# EAGLE design atxmega_e5 (EAGLE 6.5.0)
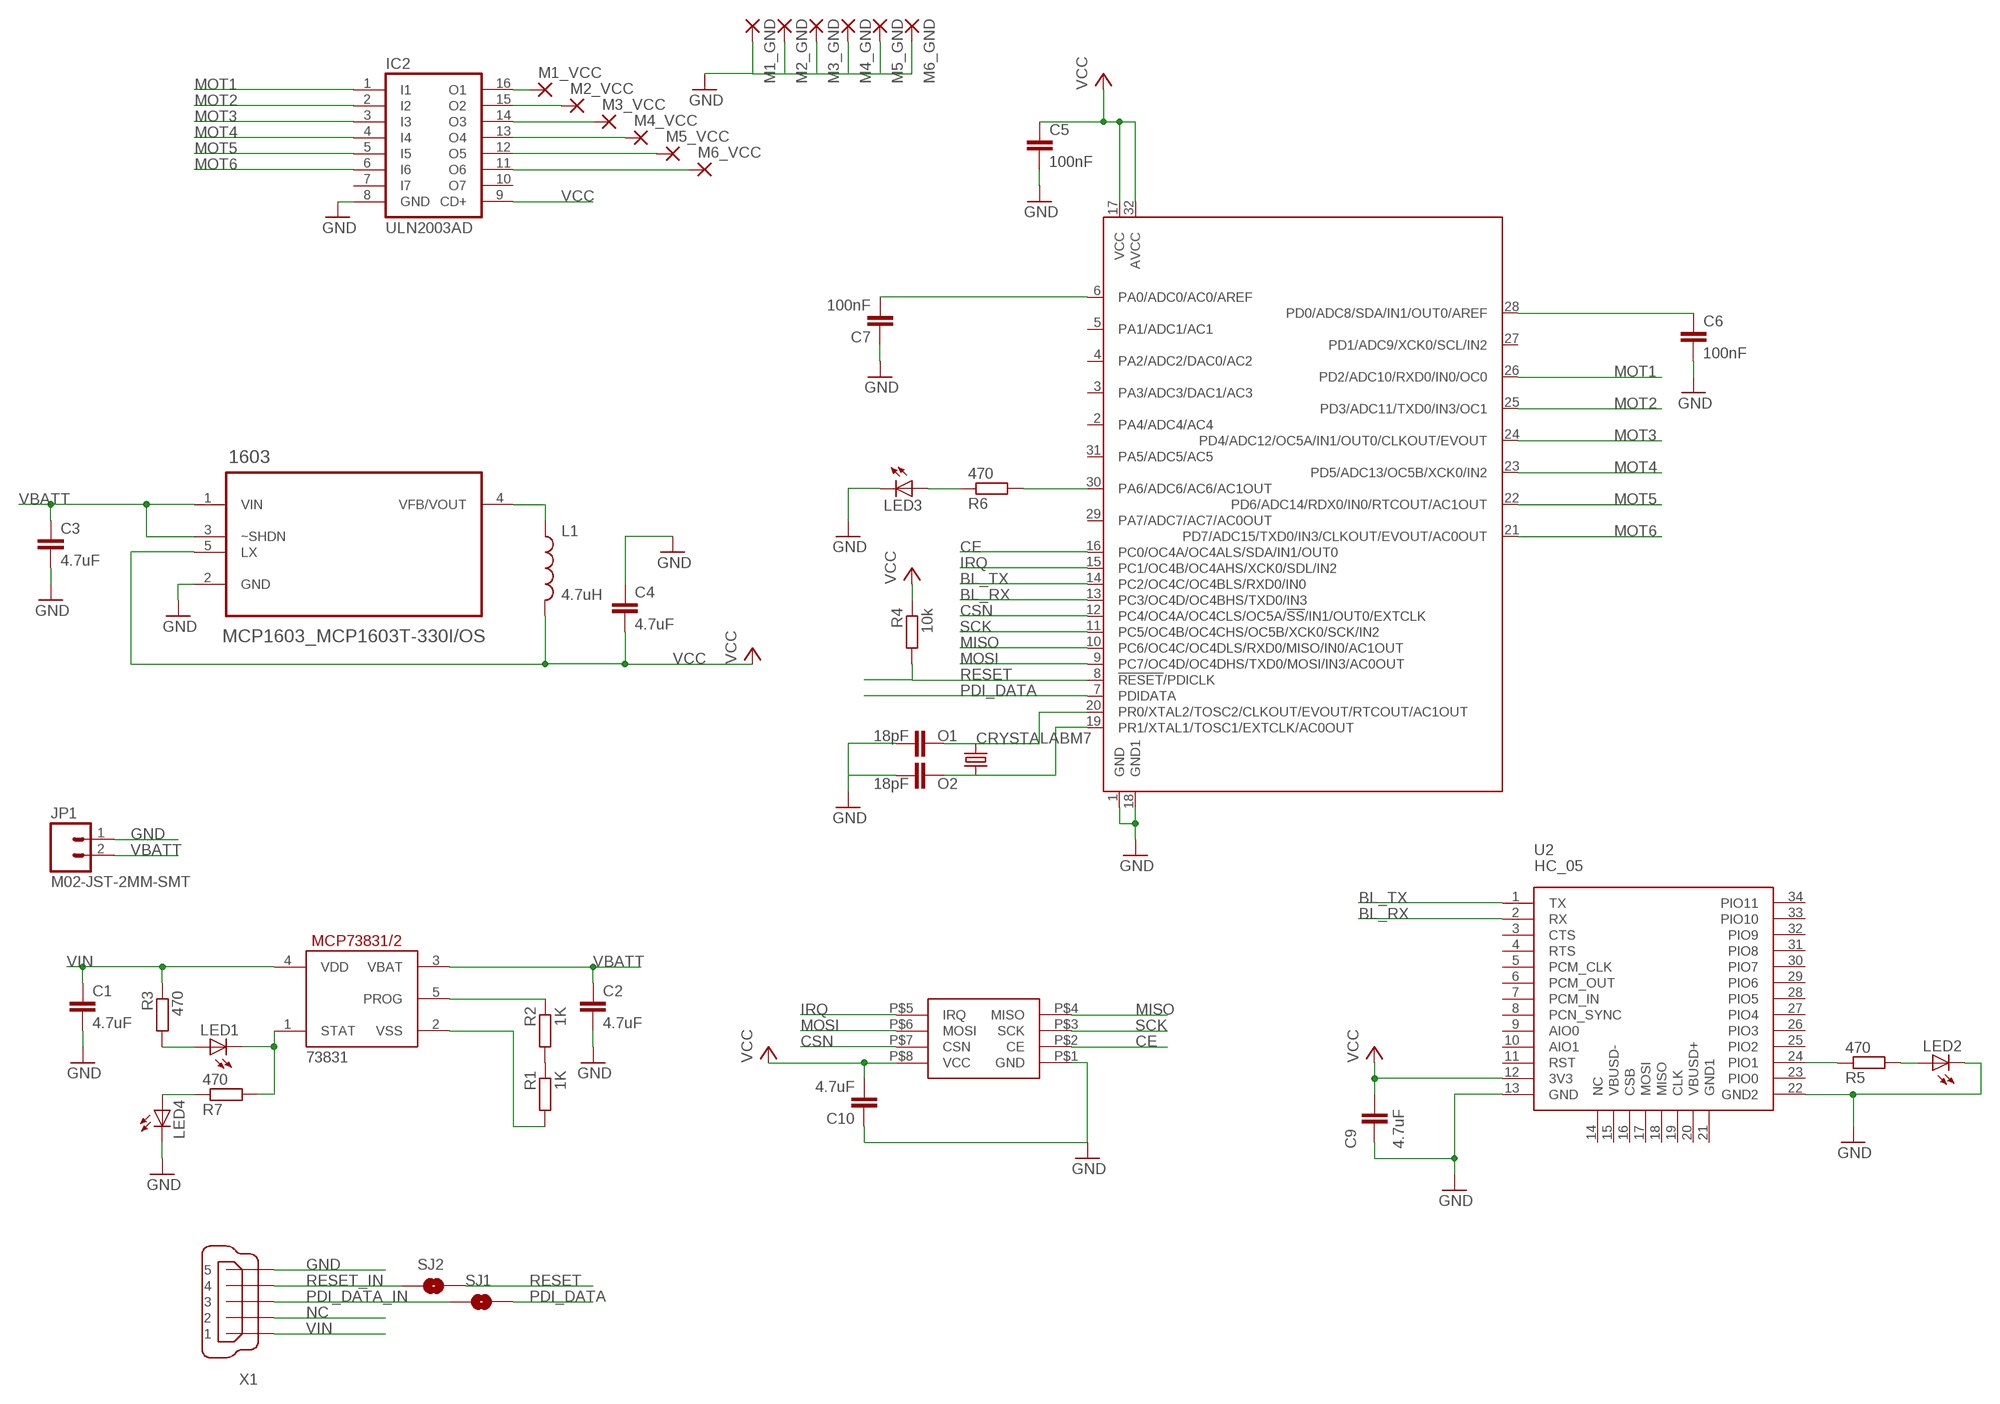
[diagram p0: schematic, sheet 1]

## Parts
1603  MCP1603_MCP1603T-330I/OS  [MCP1603_SOT95P280X110-5N]
73831  MCP73831/OT  [SOT23-5L]
C1  4.7uF  C-EUC0603K  [C0603K]
C2  4.7uF  C-EUC0603K  [C0603K]
C3  4.7uF  C-EUC0603K  [C0603K]
C4  4.7uF  C-EUC0603K  [C0603K]
C5  100nF  C-EUC0603K  [C0603K]
C6  100nF  C-EUC0603K  [C0603K]
C7  100nF  C-EUC0603K  [C0603K]
C9  4.7uF  C-EUC0603K  [C0603K]
C10  4.7uF  C-EUC0603K  [C0603K]
IC2  ULN2003AD  [SO16]
JP1  M02-JST-2MM-SMT  [JST-2-SMD]
L1  4.7uH  INDUCTOR1007  [1007]
LED1  LED0805LED  [0805LED]
LED2  LED0805LED  [0805LED]
LED3  LED0805LED  [0805LED]
LED4  LED0805LED  [0805LED]
M1_GND  WIREPAD2,15/1,0  [2,15/1,0]
M1_VCC  WIREPAD2,15/1,0  [2,15/1,0]
M2_GND  WIREPAD2,15/1,0  [2,15/1,0]
M2_VCC  WIREPAD2,15/1,0  [2,15/1,0]
M3_GND  WIREPAD2,15/1,0  [2,15/1,0]
M3_VCC  WIREPAD2,15/1,0  [2,15/1,0]
M4_GND  WIREPAD2,15/1,0  [2,15/1,0]
M4_VCC  WIREPAD2,15/1,0  [2,15/1,0]
M5_GND  WIREPAD2,15/1,0  [2,15/1,0]
M5_VCC  WIREPAD2,15/1,0  [2,15/1,0]
M6_GND  WIREPAD2,15/1,0  [2,15/1,0]
M6_VCC  WIREPAD2,15/1,0  [2,15/1,0]
O1  18pF  C-EUC0603K  [C0603K]
O2  18pF  C-EUC0603K  [C0603K]
R1  1K  R-EU_R0603  [R0603]
R2  1K  R-EU_R0603  [R0603]
R3  470  R-EU_R0603  [R0603]
R4  10k  R-EU_R0603  [R0603]
R5  470  R-EU_R0603  [R0603]
R6  470  R-EU_R0603  [R0603]
R7  470  R-EU_R0603  [R0603]
SJ1  SOLDERJUMPERNO  [SJ_2S-NO]
SJ2  SOLDERJUMPERNO  [SJ_2S-NO]
U1  ATXMEGAE5AU  [TQFP32]
U2  HC_05  [BLUETOOTH_SMD]
U$1  CRYSTALABM7  [ABM7]
U$2  NRF24L01+  [NRF24L01+]
X1  MINI-USB-32005-201  [32005-201]

## Nets
BL_RX: U1.13(PC3/OC4D/OC4BHS/TXD0/IN3) U2.2(RX)
BL_TX: U1.14(PC2/OC4C/OC4BLS/RXD0/IN0) U2.1(TX)
CE: U1.16(PC0/OC4A/OC4ALS/SDA/IN1/OUT0) U$2.P$2(CE)
CSN: U1.12(PC4/OC4A/OC4CLS/OC5A/!SS!/IN1/OUT0/EXTCLK) U$2.P$7(CSN)
GND: 1603.2(GND) C1.2 C2.2 C3.2 C4.1 C5.2 C6.2 C7.1 C9.2 C10.1 IC2.8(GND) JP1.1 LED2.C LED3.C LED4.C M1_GND.1(P) M2_GND.1(P) M3_GND.1(P) M4_GND.1(P) M5_GND.1(P) M6_GND.1(P) O1.2 O2.2 U1.1(GND) U1.18(GND1) U2.13(GND) U2.22(GND2) U$2.P$1(GND) X1.5
IRQ: U1.15(PC1/OC4B/OC4AHS/XCK0/SDL/IN2) U$2.P$5(IRQ)
MISO: U1.10(PC6/OC4C/OC4DLS/RXD0/MISO/IN0/AC1OUT) U$2.P$4(MISO)
MOSI: U1.9(PC7/OC4D/OC4DHS/TXD0/MOSI/IN3/AC0OUT) U$2.P$6(MOSI)
MOT1: IC2.1(I1) U1.26(PD2/ADC10/RXD0/IN0/OC0)
MOT2: IC2.2(I2) U1.25(PD3/ADC11/TXD0/IN3/OC1)
MOT3: IC2.3(I3) U1.24(PD4/ADC12/OC5A/IN1/OUT0/CLKOUT/EVOUT)
MOT4: IC2.4(I4) U1.23(PD5/ADC13/OC5B/XCK0/IN2)
MOT5: IC2.5(I5) U1.22(PD6/ADC14/RDX0/IN0/RTCOUT/AC1OUT)
MOT6: IC2.6(I6) U1.21(PD7/ADC15/TXD0/IN3/CLKOUT/EVOUT/AC0OUT)
N$1: O1.1 U1.20(PR0/XTAL2/TOSC2/CLKOUT/EVOUT/RTCOUT/AC1OUT) U$1.P$2
N$2: IC2.16(O1) M1_VCC.1(P)
N$3: IC2.15(O2) M2_VCC.1(P)
N$4: IC2.14(O3) M3_VCC.1(P)
N$5: IC2.13(O4) M4_VCC.1(P)
N$6: IC2.12(O5) M5_VCC.1(P)
N$7: IC2.11(O6) M6_VCC.1(P)
N$8: O2.1 U1.19(PR1/XTAL1/TOSC1/EXTCLK/AC0OUT) U$1.P$1
N$9: 1603.4(VFB/VOUT) L1.1
N$10: LED1.A R3.2
N$11: 73831.1(STAT) LED1.C R7.2
N$12: 73831.5(PROG) R2.1
N$13: R1.1 R2.2
N$14: 73831.2(VSS) R1.2
N$15: LED3.A R6.1
N$16: R6.2 U1.30(PA6/ADC6/AC6/AC1OUT)
N$17: LED4.A R7.1
N$20: LED2.A R5.2
N$21: R5.1 U2.24(PIO1)
N$24: C6.1 U1.28(PD0/ADC8/SDA/IN1/OUT0/AREF)
N$25: C7.2 U1.6(PA0/ADC0/AC0/AREF)
NC: X1.2
PDI_DATA: SJ1.2 U1.7(PDIDATA)
PDI_DATA_IN: SJ1.1 X1.3
RESET: R4.2 SJ2.2 U1.8(!RESET!/PDICLK)
RESET_IN: SJ2.1 X1.4
SCK: U1.11(PC5/OC4B/OC4CHS/OC5B/XCK0/SCK/IN2) U$2.P$3(SCK)
VBATT: 1603.1(VIN) 1603.3(~SHDN) 73831.3(VBAT) C2.1 C3.1 JP1.2
VCC: 1603.5(LX) C4.2 C5.1 C9.1 C10.2 IC2.9(CD+) L1.2 R4.1 U1.17(VCC) U1.32(AVCC) U2.12(3V3) U$2.P$8(VCC)
VIN: 73831.4(VDD) C1.1 R3.1 X1.1
Unconnected: IC2.7(I7) IC2.10(O7) U1.2(PA4/ADC4/AC4) U1.3(PA3/ADC3/DAC1/AC3) U1.4(PA2/ADC2/DAC0/AC2) U1.5(PA1/ADC1/AC1) U1.27(PD1/ADC9/XCK0/SCL/IN2) U1.29(PA7/ADC7/AC7/AC0OUT) U1.31(PA5/ADC5/AC5) U2.3(CTS) U2.4(RTS) U2.5(PCM_CLK) U2.6(PCM_OUT) U2.7(PCM_IN) U2.8(PCN_SYNC) U2.9(AIO0) U2.10(AIO1) U2.11(RST) U2.14(NC) U2.15(VBUSD-) U2.16(CSB) U2.17(MOSI) U2.18(MISO) U2.19(CLK) U2.20(VBUSD+) U2.21(GND1) U2.23(PIO0) U2.25(PIO2) U2.26(PIO3) U2.27(PIO4) U2.28(PIO5) U2.29(PIO6) U2.30(PIO7) U2.31(PIO8) U2.32(PIO9) U2.33(PIO10) U2.34(PIO11)

## Library data of the parts
1603 = doska-digital:MCP1603_MCP1603T-330I/OS: 2.0 MHz, 500 mA Synchronous Buck Regulator; MPN: MCP1603T-330I/OS; OC_FARNELL: 1439373; OC_NEWARK: 22K1332; PACKAGE: SOT23-5; SUPPLIER: Microchip
73831 = adafruit:MCP73831: MCP73831/2 Miniature Single-Cell, Fully Integrated Li-Ion, Li-Polymer Charge Management Controllers. Nice and small simple lipoly charge controller, with adjustable current and status output (LED) http://www.ladyada.net/library/pcb/eaglelibrary.html
C1-C7 C9 C10 O1 O2 = resistor:C-EU: CAPACITOR, European symbol
IC2 = uln-udn:ULN2003A: DRIVER ARRAY
JP1 = SparkFun-Connectors:M02: Standard 2-pin 0.1" header. Use with - straight break away headers ( PRT-00116) - right angle break away headers (PRT-00553) - swiss pins (PRT-00743) - machine pins (PRT-00117) - female headers (PRT-00115) Molex polarized connector foot print use with: PRT-08233 with associated crimp pins and housings. 2.54_SCREWTERM for use with PRT-10571. 3.5mm Screw Terminal footprints for PRT-08084 5mm Screw Terminal footprints for use with PRT-08433; PROD_ID: CONN-08352
L1 = SparkFun-Passives:INDUCTOR: Inductors Basic Inductor/Choke - 0603 and 1206. Footprints are not proven and vary greatly between part numbers. SRN6045- 33uH, 20% 1.4A SDR0403-560KL - 56uH, 10%, 500mA RMS/740mA peak
LED1-LED4 = LEDs:LED
M1_GND M1_VCC M2_GND M2_VCC M3_GND M3_VCC M4_GND M4_VCC M5_GND M5_VCC M6_GND M6_VCC = wirepad:WIREPAD: Wire PAD connect wire on PCB
R1-R7 = resistor:R-EU_: RESISTOR, European symbol
SJ1 SJ2 = SparkFun-Passives:SOLDERJUMPER: Solder Jumper Standard SMD solder jumper. Used to automate production. Two varients : Normally Open and Normally Closed are the same, but have different paste layers. NC will have a large amount of paste and should jumper during reflow.
U1 = 01jyd:ATXMEGAE5
U2 = Bluetooth HC-05:HC_05: HC-05 Bluetooth Module
U$1 = atmega32u4-breakout-v3:CRYSTAL
U$2 = muzy_robot:NRF24L01+: NRF24L01+ module
X1 = con-cypressindustries:MINI-USB-: MINI USB-B Conector Source: www.cypressindustries.com; OC_FARNELL: unknown; OC_NEWARK: unknown

## Board
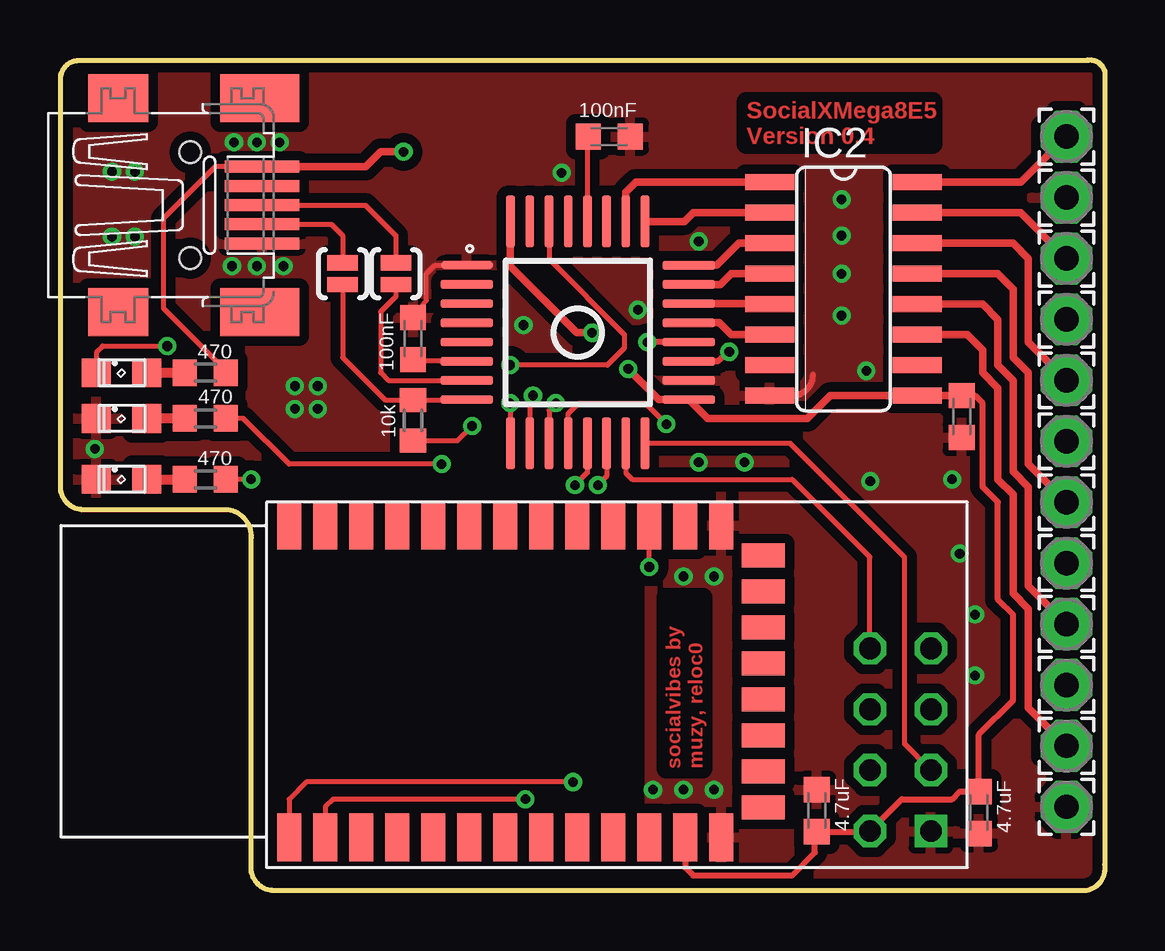
[diagram p1: board, top side]
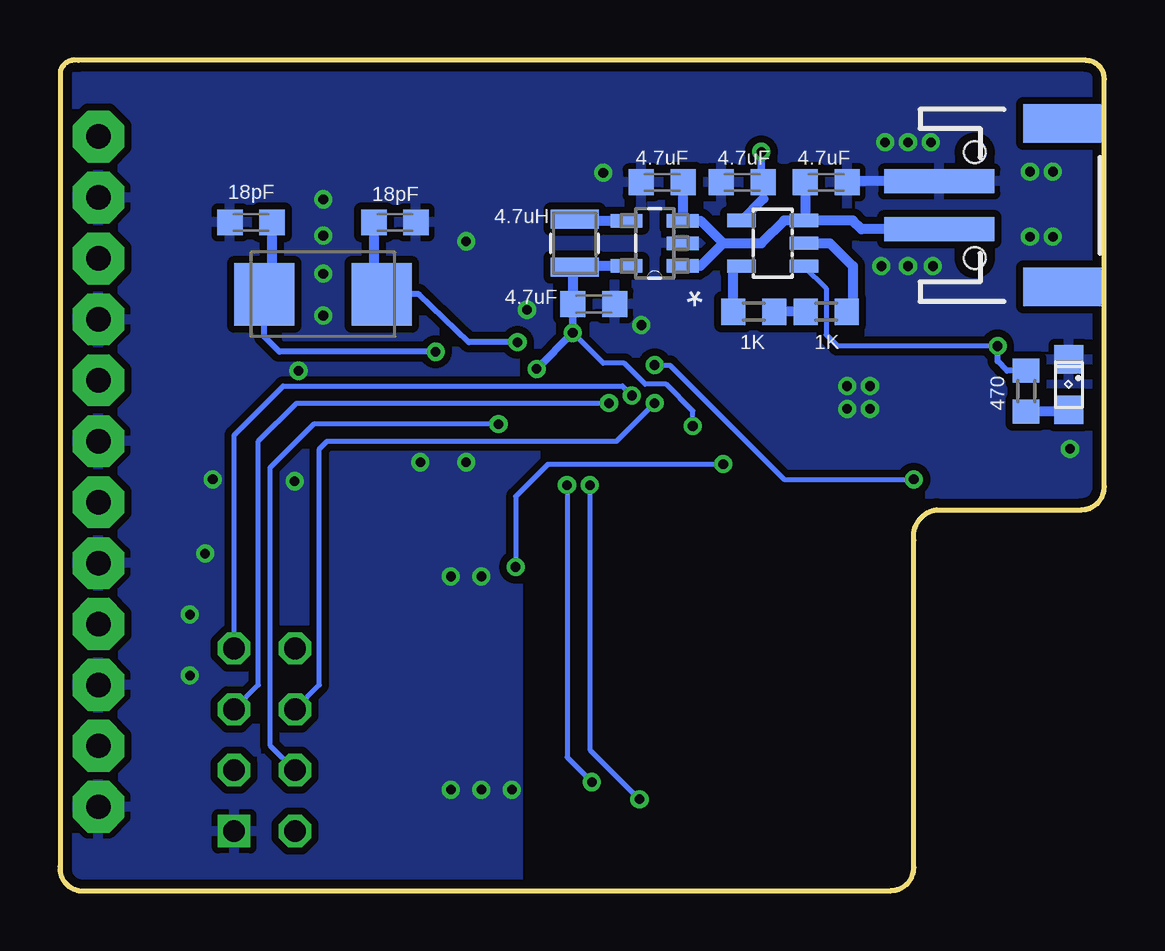
[diagram p2: board, bottom side, seen from below]

Size 43.51 x 34.63 mm. Coordinates in mm from the lower left corner, seen from the top.
Outline: 0,33.85 arc-90 0.76,34.61 42.74,34.61 arc-90 43.5,34.16 43.5,1.08 arc-90 42.74,0 8.89,0 arc-90 7.94,0.95 7.94,14.61 arc90 6.98,15.88 0.95,15.88 arc-90 0,16.83 0,33.85
Copper layers (1*16): Top 0.0356mm / dielectric 1.5011mm / Bottom 0.0356mm
Design rules "LaenPCBOrder": minimum track width 6mil, minimum drill 13mil, track to track 6mil, track to pad 6mil, pad to pad 6mil, via to via 6mil, smd to smd 6mil, copper to edge 15mil, drill to drill 6mil, minimum pad ring 7mil, minimum via ring 7mil, stop-mask expansion 3mil, vias tented up to drill 0mil, thermal gap 10mil
tRestrict: area 8.6,2.2 to 23.8,14.9
bRestrict: area 8.6,0.3 to 23.8,14.9

### Footprints (pad centres in the part's own frame; a part is rotated, then mirrored left to right if it is on the bottom)
MCP1603_SOT95P280X110-5N = smd 1.321 x 0.559: 1 -1.168,0.94; 2 -1.168,0; 3 -1.168,-0.94; 4 1.168,-0.94; 5 1.168,0.94
SOT23-5L = smd 0.55 x 1.2: 1 -0.95,-1.3; 2 0,-1.3; 3 0.95,-1.3; 4 0.95,1.3; 5 -0.95,1.3
C0603K = smd 1.05 x 1.08: 1 -0.875,0; 2 0.875,0
SO16 = smd 0.66 x 2.032: 1 -4.445,-3.073; 2 -3.175,-3.073; 3 -1.905,-3.073; 4 -0.635,-3.073; 5 0.635,-3.073; 6 1.905,-3.073; 7 3.175,-3.073; 8 4.445,-3.073; 9 4.445,3.073; 10 3.175,3.073; 11 1.905,3.073; 12 0.635,3.073; 13 -0.635,3.073; 14 -1.905,3.073; 15 -3.175,3.073; 16 -4.445,3.073
JST-2-SMD = smd 1 x 4.6: 1 -1,-3.7; 2 1,-3.7 | smd 1.6 x 3.4: NC1 -3.4,1.5; NC2 3.4,1.5
1007 = smd 2 x 0.8: 1 0,1; 2 0,-1
0805LED = smd 1.2 x 1.2: A 1.05,0; C -1.05,0
2,15/1,0 = drill 1.016 pad 2.159 octagon: 1 0,0
R0603 = smd 1 x 1.1: 1 -0.85,0; 2 0.85,0
SJ_2S-NO = smd 0.635 x 1.27: 1 -0.45,0; 2 0.45,0
TQFP32 = smd 2.17 x 0.36: 1 -4.625,2.8; 2 -4.625,2; 3 -4.625,1.2; 4 -4.625,0.4; 5 -4.625,-0.4; 6 -4.625,-1.2; 7 -4.625,-2; 8 -4.625,-2.8; 17 4.625,-2.8; 18 4.625,-2; 19 4.625,-1.2; 20 4.625,-0.4; 21 4.625,0.4; 22 4.625,1.2; 23 4.625,2; 24 4.625,2.8 | smd 0.36 x 2.17: 9 -2.8,-4.625; 10 -2,-4.625; 11 -1.2,-4.625; 12 -0.4,-4.625; 13 0.4,-4.625; 14 1.2,-4.625; 15 2,-4.625; 16 2.8,-4.625; 25 2.8,4.625; 26 2,4.625; 27 1.2,4.625; 28 0.4,4.625; 29 -0.4,4.625; 30 -1.2,4.625; 31 -2,4.625; 32 -2.8,4.625
BLUETOOTH_SMD = smd 2 x 1: 1 -6.35,3.81; 2 -6.35,2.31; 3 -6.35,0.81; 4 -6.35,-0.69; 5 -6.35,-2.19; 6 -6.35,-3.69; 7 -6.35,-5.19; 8 -6.35,-6.69; 9 -6.35,-8.19; 10 -6.35,-9.69; 11 -6.35,-11.19; 12 -6.35,-12.69; 13 -6.35,-14.19; 22 6.65,-14.19; 23 6.65,-12.69; 24 6.65,-11.19; 25 6.65,-9.69; 26 6.65,-8.19; 27 6.65,-6.69; 28 6.65,-5.19; 29 6.65,-3.69; 30 6.65,-2.19; 31 6.65,-0.69; 32 6.65,0.81; 33 6.65,2.31; 34 6.65,3.81 | smd 1 x 1.8: 14 -5.1,-15.94; 15 -3.6,-15.94; 16 -2.1,-15.94; 17 -0.6,-15.94; 18 0.9,-15.94; 19 2.4,-15.94; 20 3.9,-15.94; 21 5.4,-15.94
ABM7 = smd 2.5 x 2.6: P$1 -2.45,0; P$2 2.45,0
NRF24L01+ = drill 0.9 square: P$1 -1.016,1.016 | drill 0.9 octagon: P$2 -1.016,-1.524; P$3 -1.016,-4.064; P$4 -1.016,-6.604; P$5 1.524,-6.604; P$6 1.524,-4.064; P$7 1.524,-1.524; P$8 1.524,1.016
32005-201 = smd 3.1 x 0.5: 1 3,1.6; 2 3,0.8; 3 3,0; 4 3,-0.8; 5 3,-1.6 | smd 2.5 x 2: M1 -3,-4.45; M2 -3,4.45 | smd 3.3 x 2: M3 2.9,4.45; M4 2.9,-4.45 | hole 0.9: 0,2.2; 0,-2.2

### Placement (x,y rotation side)
1603  18.73,26.99 180 bottom
73831  13.81,26.99 90 bottom
C1  15.08,29.53 180 bottom
C2  11.59,29.53 0 bottom
C3  18.41,29.53 180 bottom
C4  21.27,24.45 180 bottom
C5  37.54,19.76 270 top
C6  22.86,31.43 0 top
C7  14.68,23.02 270 top
C9  31.51,3.33 90 top
C10  38.26,3.25 90 top
IC2  32.62,25.08 270 top
JP1  3.17,28.58 270 bottom
L1  22.07,26.99 0 bottom
LED1  2.54,21.59 0 top
LED2  2.54,19.69 0 top
LED3  2.54,17.14 0 top
LED4  1.48,21.1 270 bottom
M1_GND  41.91,28.89 0 top
M1_VCC  41.91,31.43 0 top
M2_GND  41.91,23.81 0 top
M2_VCC  41.91,26.35 0 top
M3_GND  41.91,18.73 0 top
M3_VCC  41.91,21.27 0 top
M4_GND  41.91,13.65 0 top
M4_VCC  41.91,16.19 0 top
M5_GND  41.91,8.57 0 top
M5_VCC  41.91,11.11 0 top
M6_GND  41.91,3.49 0 top
M6_VCC  41.91,6.03 0 top
O1  29.55,27.86 0 bottom
O2  35.55,27.86 180 bottom
R1  11.59,24.13 0 bottom
R2  14.61,24.13 0 bottom
R3  6.03,21.59 180 top
R4  14.68,19.61 90 top
R5  6.03,19.69 180 top
R6  6.03,17.14 0 top
R7  3.25,20.83 90 bottom
SJ1  13.97,25.72 270 top
SJ2  11.75,25.72 270 top
U1  21.55,23.27 0 top
U2  13.34,8.57 90 top
U$1  32.55,24.86 0 bottom
U$2  35.24,3.49 180 top
X1  5.4,28.58 0 top

### Tracks (layer width: path | path; a pad name or v marks a point on that pad's centre or on a via)
BL_RX  (via drill 0.4)
  Top 0.203: U1.13 21.95,17.43 v21.43,16.91 | v19.37,3.81 11.35,3.81 11.03,3.49 U2.2
  Bottom 0.203: v21.43,16.91 21.43,5.87 v19.37,3.81
BL_TX  (via drill 0.4)
  Top 0.203: U1.14 22.75,17.27 v22.38,16.91 | v21.35,4.52 10.24,4.52 9.53,3.81 U2.1
  Bottom 0.203: v22.38,16.91 22.38,5.56 v21.35,4.52
CE
  Top 0.203: U$2.P$2 35.16,6.11 35.16,13.89 30.41,18.65 U1.16
CSN  (via drill 0.4)
  Top 0.203: U1.12 21.15,19.88 21.59,20.32 24.37,20.32 v25.24,19.45
  Bottom 0.203: v25.24,19.45 32.94,19.45 34.77,17.62 34.77,6.06 U$2.P$7
GND  (via drill 0.4)
  Top 0.203: C7.1 15.24,24.61 15.24,25.72 15.59,26.07 U1.1
  Top 0.254: IC2.8 30.48,20.64 arc90 31.35,21.51
  Bottom 0.406: JP1.1 10.67,29.58 C2.2
  other vias: 37.15,17.14 33.73,17.07 38.1,8.97 38.1,11.51 37.46,14.05 26.59,17.86 28.5,17.86 24.05,24.21 19.29,23.57 26.59,27.07 8.18,26.03 3.1,27.26 3.1,29.97 2.14,29.97 2.14,27.26 7.14,26.03 9.29,26.03 7.22,31.19 8.18,31.19 9.13,31.19 20.88,29.92 9.76,20.08 10.72,20.08 9.76,21.03 10.72,21.03 25.96,13.1 25.96,4.21 27.23,4.21 24.69,4.21 27.23,13.1 1.43,18.41 32.54,28.81 32.54,25.72 32.54,27.3 32.54,23.97 33.58,21.67
  pour Top (isolate 0.406): 77.79,35.88 -0.64,36.2 -0.95,-0.64 77.47,-0.64
  pour Bottom (isolate 0.305): -0.95,36.2 61.6,36.2 61.6,-0.95 -0.95,-0.95
IRQ
  Top 0.203: U1.15 23.55,17.41 23.81,17.14 30.48,17.14 33.72,13.91 U$2.P$5
MISO  (via drill 0.4)
  Top 0.203: v19.68,20.64 19.55,20.5 U1.10
  Bottom 0.203: U$2.P$4 36.26,18.99 34.21,21.03 20.08,21.03 v19.68,20.64
MOSI  (via drill 0.4)
  Top 0.203: v18.73,20.32 18.73,18.66 U1.9
  Bottom 0.203: U$2.P$6 32.7,8.57 32.7,18.41 32.38,18.73 20.32,18.73 v18.73,20.32
MOT1
  Top 0.305: U1.26 23.55,29.11 23.97,29.53 IC2.1
MOT2
  Top 0.305: U1.25 25.99,27.9 26.35,28.26 IC2.2
MOT3
  Top 0.305: U1.24 27.34,26.07 28.26,26.99 IC2.3
MOT4
  Top 0.305: U1.23 27.49,25.27 27.94,25.72 IC2.4
MOT5
  Top 0.305: U1.22 29.29,24.47 IC2.5
MOT6
  Top 0.305: U1.21 27.45,23.67 27.94,23.18 IC2.6
N$1  (via drill 0.4)
  Top 0.254: U1.20 24.6,22.87 v24.45,22.86
  Bottom 0.254: v24.45,22.86 26.48,22.86 28.55,24.86 U$1.P$2
  Bottom 0.406: O1.1 30.43,24.86 U$1.P$2
N$2
  Top 0.305: IC2.16 40.01,29.53 M1_VCC.1
N$3
  Top 0.305: IC2.15 40.01,28.26 M2_VCC.1
N$4
  Top 0.305: M3_VCC.1 40.32,22.86 40.32,26.35 39.69,26.99 IC2.14
N$5
  Top 0.305: IC2.13 39.05,25.72 39.69,25.08 39.69,22.22 40.32,21.59 40.32,17.78 M4_VCC.1
N$6
  Top 0.305: IC2.12 38.42,24.45 39.05,23.81 39.05,21.91 39.69,21.27 39.69,17.46 40.32,16.83 40.32,12.7 M5_VCC.1
N$7
  Top 0.305: IC2.11 37.78,23.18 38.42,22.54 38.42,21.59 39.05,20.96 39.05,17.14 39.69,16.51 39.69,12.38 40.32,11.75 40.32,7.62 M6_VCC.1
N$8  (via drill 0.4)
  Top 0.254: U1.19 27.39,22.07 v27.86,22.46
  Bottom 0.254: v27.86,22.46 34.37,22.46 35,23.1 U$1.P$1
  Bottom 0.406: O2.1 34.68,24.86 U$1.P$1
N$9
  Bottom 0.406: L1.1 arc-90 22.01,27.93 1603.4
N$10
  Top 0.406: LED1.A R3.2
N$11  (via drill 0.4)
  Top 0.203: LED1.C 1.49,22.44 1.75,22.7 v4.45,22.7
  Bottom 0.203: 73831.1 11.59,25.12 11.59,23.18 11.11,22.7 v4.45,22.7
  Bottom 0.254: R7.2 4.06,21.68 4.45,22.07 v4.45,22.7
N$12
  Bottom 0.406: R2.1 15.45,26.04 73831.5
N$13
  Bottom 0.406: R1.1 R2.2
N$14
  Bottom 0.406: 73831.2 11.43,26.99 10.48,26.03 10.48,24.39 R1.2
N$15
  Top 0.406: LED3.A R6.1
N$16  (via drill 0.4)
  Top 0.203: U1.30 20.35,26.32 23.5,23.18 23.5,22.62 22.78,21.91 v18.73,21.91 | v7.94,17.14 R6.2
  Bottom 0.203: v18.73,21.91 18.1,21.91 13.34,17.14 v7.94,17.14
N$17
  Bottom 0.406: LED4.A 1.54,19.98 R7.1
N$20
  Top 0.406: R5.2 LED2.A
N$21  (via drill 0.4)
  Top 0.203: 24.45,15.3 U2.24 v24.52,13.5 v24.53,13.49 | v15.88,17.78 9.53,17.78 7.62,19.69 R5.1
  Bottom 0.203: v15.88,17.78 23.18,17.78 24.53,16.43 v24.53,13.49
N$24
  Top 0.203: C6.1 21.95,31.4 U1.28
N$25
  Top 0.203: U1.6 14.92,22.07 arc-90 C7.2
PDI_DATA
  Top 0.203: SJ1.2 13.97,24.76 13.34,24.13 13.34,21.59 13.65,21.27 U1.7
PDI_DATA_IN
  Top 0.203: X1.3 12.7,28.58 13.97,27.31 SJ1.1
RESET
  Top 0.203: U1.8 16.91,20.46 R4.2 13.52,20.46 11.75,22.22 SJ2.2
RESET_IN
  Top 0.203: X1.4 11.28,27.78 11.75,27.31 SJ2.1
SCK  (via drill 0.4)
  Top 0.203: v20.64,20.32 20.35,20.03 U1.11
  Bottom 0.203: U$2.P$3 35.24,8.57 35.24,18.73 33.66,20.32 v20.64,20.32
VBATT
  Bottom 0.406: C2.1 12.46,27.94 73831.3 | JP1.2 10.11,27.58 10.48,27.94 73831.3 | 73831.3 13.34,27.94 14.29,26.99 15.88,26.99 | 15.88,26.99 16.82,27.93 1603.3 17.56,29.5 C3.1 | 1603.1 16.82,26.05 15.88,26.99
VCC  (via drill 0.4)
  Top 0.203: C5.1 37.23,20.64 | 18.73,27.88 U1.32 | R4.1 16.53,18.76 v17.14,19.37
  Top 0.254: U2.12 26.02,0.96 26.35,0.63 30.48,0.63 31.43,1.59 31.43,2.38 C9.1 33.7,2.46 U$2.P$8 35.05,3.81 37.15,3.81 37.47,4.13 C10.2 38.26,6.51 39.69,7.94 39.69,11.51 39.05,12.14 39.05,16.19 38.42,16.83 38.42,20.32 38.1,20.64 37.23,20.64 C5.1
  Top 0.305: 37.23,20.64 IC2.9 32.07,20.64 31.12,19.69 26.96,19.69 U1.17 24.93,20.47 v23.65,21.75 | 18.73,27.88 18.73,26.03 21.51,23.26 v22.15,23.26 22.23,23.18
  Bottom 0.203: v17.14,19.37 17.14,20 18.26,21.11 19.13,21.11 20,21.99 20.88,21.99 v22.15,23.26
  Bottom 0.305: v23.65,21.75 v22.15,23.26 C4.2
  Bottom 0.406: 1603.5 22.01,26.05 arc-90 L1.2 arc-90 22.15,25.91 C4.2
VIN  (via drill 0.4)
  Top 0.203: X1.1 6.44,30.17 4.29,28.02 4.29,24.29 6.83,21.75
  Top 0.254: 6.83,21.75 6.83,21.65 arc90 R3.1
  Top 0.305: X1.1 12.71,30.17 13.34,30.8 v14.29,30.8
  Bottom 0.203: 14.29,29.61 C1.1
  Bottom 0.305: 14.21,28.84 C1.1 | v14.29,30.8 14.29,29.61
  Bottom 0.406: 73831.4 14.21,28.84

### Text on the board
Top: SocialXMega8E5 / Version 0.4 | socialvibes by / muzy, reloc0